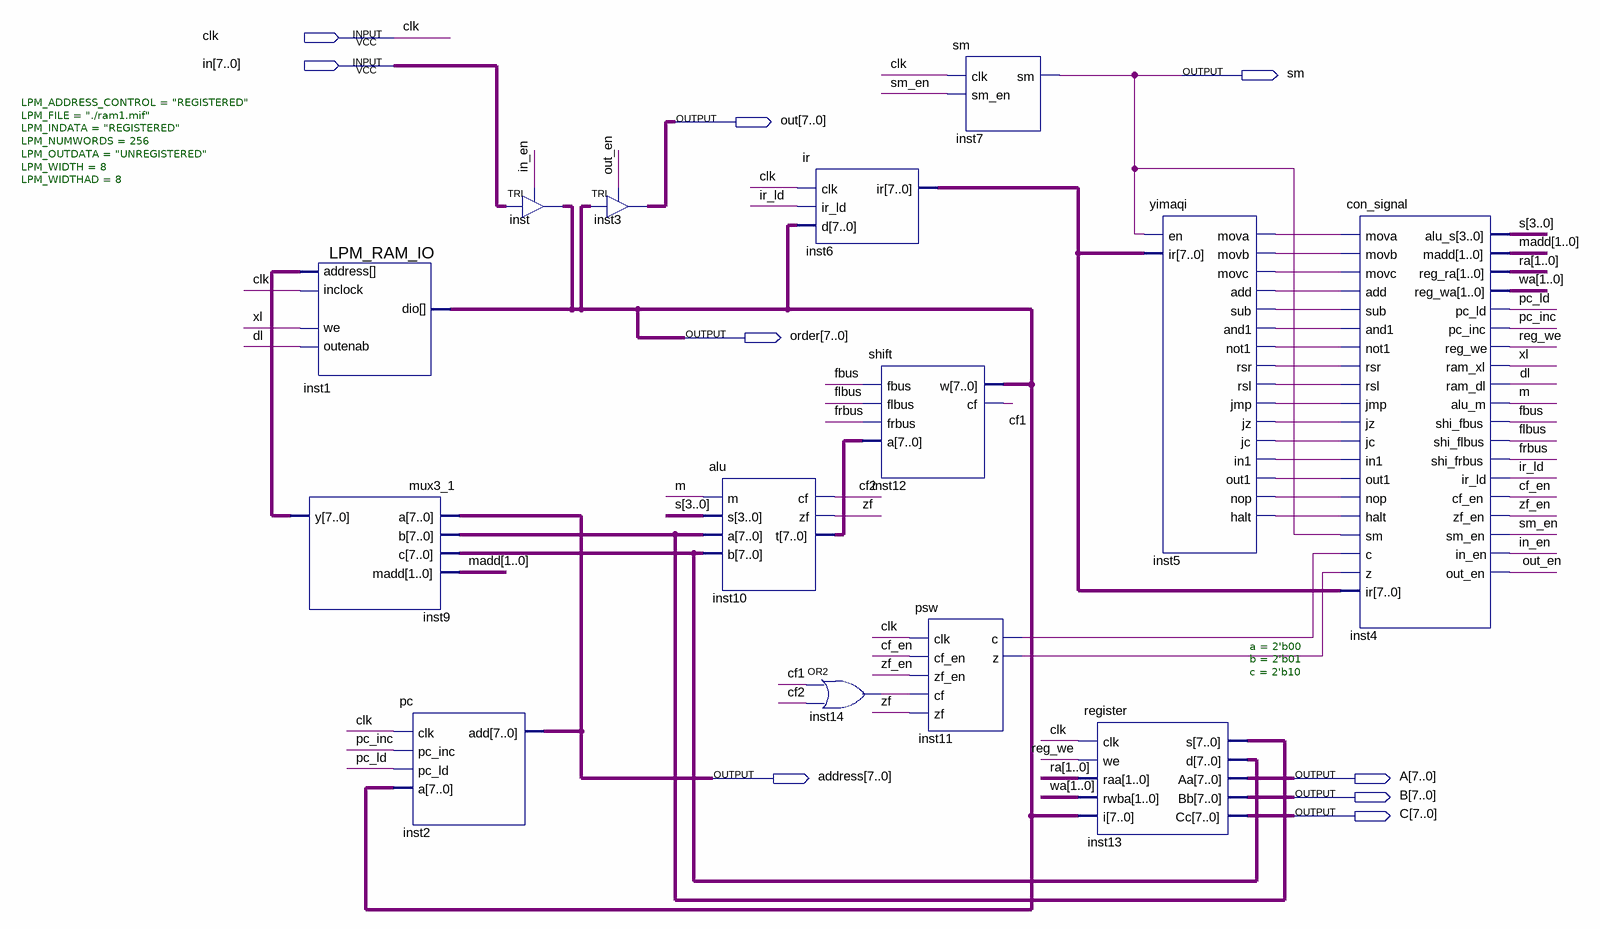
[diagram p0: schematic sheet]
// Quartus schematic mc.bdf as structural Verilog: 14 symbols, 9 pins
module mc (
  input  clk,
  input  [7:0] in,
  output sm,
  output [7:0] out,
  output [7:0] order,
  output [7:0] address,
  output [7:0] A,
  output [7:0] B,
  output [7:0] C
);

  wire cf1, cf2, cf_en, dl, fbus, flbus, frbus, in_en, inst5_add, inst5_and1, inst5_halt, inst5_in1,
       inst5_jc, inst5_jmp, inst5_jz, inst5_mova, inst5_movb, inst5_movc, inst5_nop, inst5_not1, inst5_out1,
       inst5_rsl, inst5_rsr, inst5_sub, inst11_c, inst11_z, inst14_out, ir_ld, m, out_en, pc_inc, pc_ld,
       reg_we, sm_en, xl, zf, zf_en;
  wire [1:0] madd, ra, wa;
  wire [3:0] s;
  wire [7:0] inst6_ir, inst9_y, inst10_t, inst13_d, inst13_s;

  LPM_RAM_IO #(.LPM_ADDRESS_CONTROL("REGISTERED"), .LPM_FILE("./ram1.mif"), .LPM_INDATA("REGISTERED"), .LPM_NUMWORDS(256), .LPM_OUTDATA("UNREGISTERED"), .LPM_WIDTH(8), .LPM_WIDTHAD(8)) inst1 (
    .address(inst9_y), .inclock(clk), .we(xl), .outenab(dl), .dio(order));
  mux3_1 inst9 (.a(address), .b(inst13_s), .c(inst13_d), .madd(madd), .y(inst9_y));
  pc inst2 (.clk(clk), .pc_inc(pc_inc), .pc_ld(pc_ld), .a(order), .add(address));
  TRI inst[7:0] (.IN(in), .OE(in_en), .OUT(order));
  TRI inst3[7:0] (.IN(order), .OE(out_en), .OUT(out));
  alu inst10 (.m(m), .s(s), .a(inst13_s), .b(inst13_d), .cf(cf2), .zf(zf), .t(inst10_t));
  ir inst6 (.clk(clk), .ir_ld(ir_ld), .d(order), .ir(inst6_ir));
  or inst14 (inst14_out, cf1, cf2);
  shift inst12 (.fbus(fbus), .flbus(flbus), .frbus(frbus), .a(inst10_t), .w(order), .cf(cf1));
  sm inst7 (.clk(clk), .sm_en(sm_en), .sm(sm));
  psw inst11 (.clk(clk), .cf_en(cf_en), .zf_en(zf_en), .cf(inst14_out), .zf(zf), .c(inst11_c), .z(inst11_z));
  register #(.a(2'b00), .b(2'b01), .c(2'b10)) inst13 (
    .clk(clk), .we(reg_we), .raa(ra), .rwba(wa), .i(order), .s(inst13_s), .d(inst13_d), .Aa(A), .Bb(B), .Cc(C));
  yimaqi inst5 (
    .en(sm), .ir(inst6_ir), .mova(inst5_mova), .movb(inst5_movb), .movc(inst5_movc), .add(inst5_add),
    .sub(inst5_sub), .and1(inst5_and1), .not1(inst5_not1), .rsr(inst5_rsr), .rsl(inst5_rsl), .jmp(inst5_jmp),
    .jz(inst5_jz), .jc(inst5_jc), .in1(inst5_in1), .out1(inst5_out1), .nop(inst5_nop), .halt(inst5_halt));
  con_signal inst4 (
    .mova(inst5_mova), .movb(inst5_movb), .movc(inst5_movc), .add(inst5_add), .sub(inst5_sub),
    .and1(inst5_and1), .not1(inst5_not1), .rsr(inst5_rsr), .rsl(inst5_rsl), .jmp(inst5_jmp), .jz(inst5_jz),
    .jc(inst5_jc), .in1(inst5_in1), .out1(inst5_out1), .nop(inst5_nop), .halt(inst5_halt), .sm(sm),
    .c(inst11_c), .z(inst11_z), .ir(inst6_ir), .alu_s(s), .madd(madd), .reg_ra(ra), .reg_wa(wa),
    .pc_ld(pc_ld), .pc_inc(pc_inc), .reg_we(reg_we), .ram_xl(xl), .ram_dl(dl), .alu_m(m), .shi_fbus(fbus),
    .shi_flbus(flbus), .shi_frbus(frbus), .ir_ld(ir_ld), .cf_en(cf_en), .zf_en(zf_en), .sm_en(sm_en),
    .in_en(in_en), .out_en(out_en));
endmodule
